# EAGLE schematic IR_Sensor (EAGLE 9.6.2)
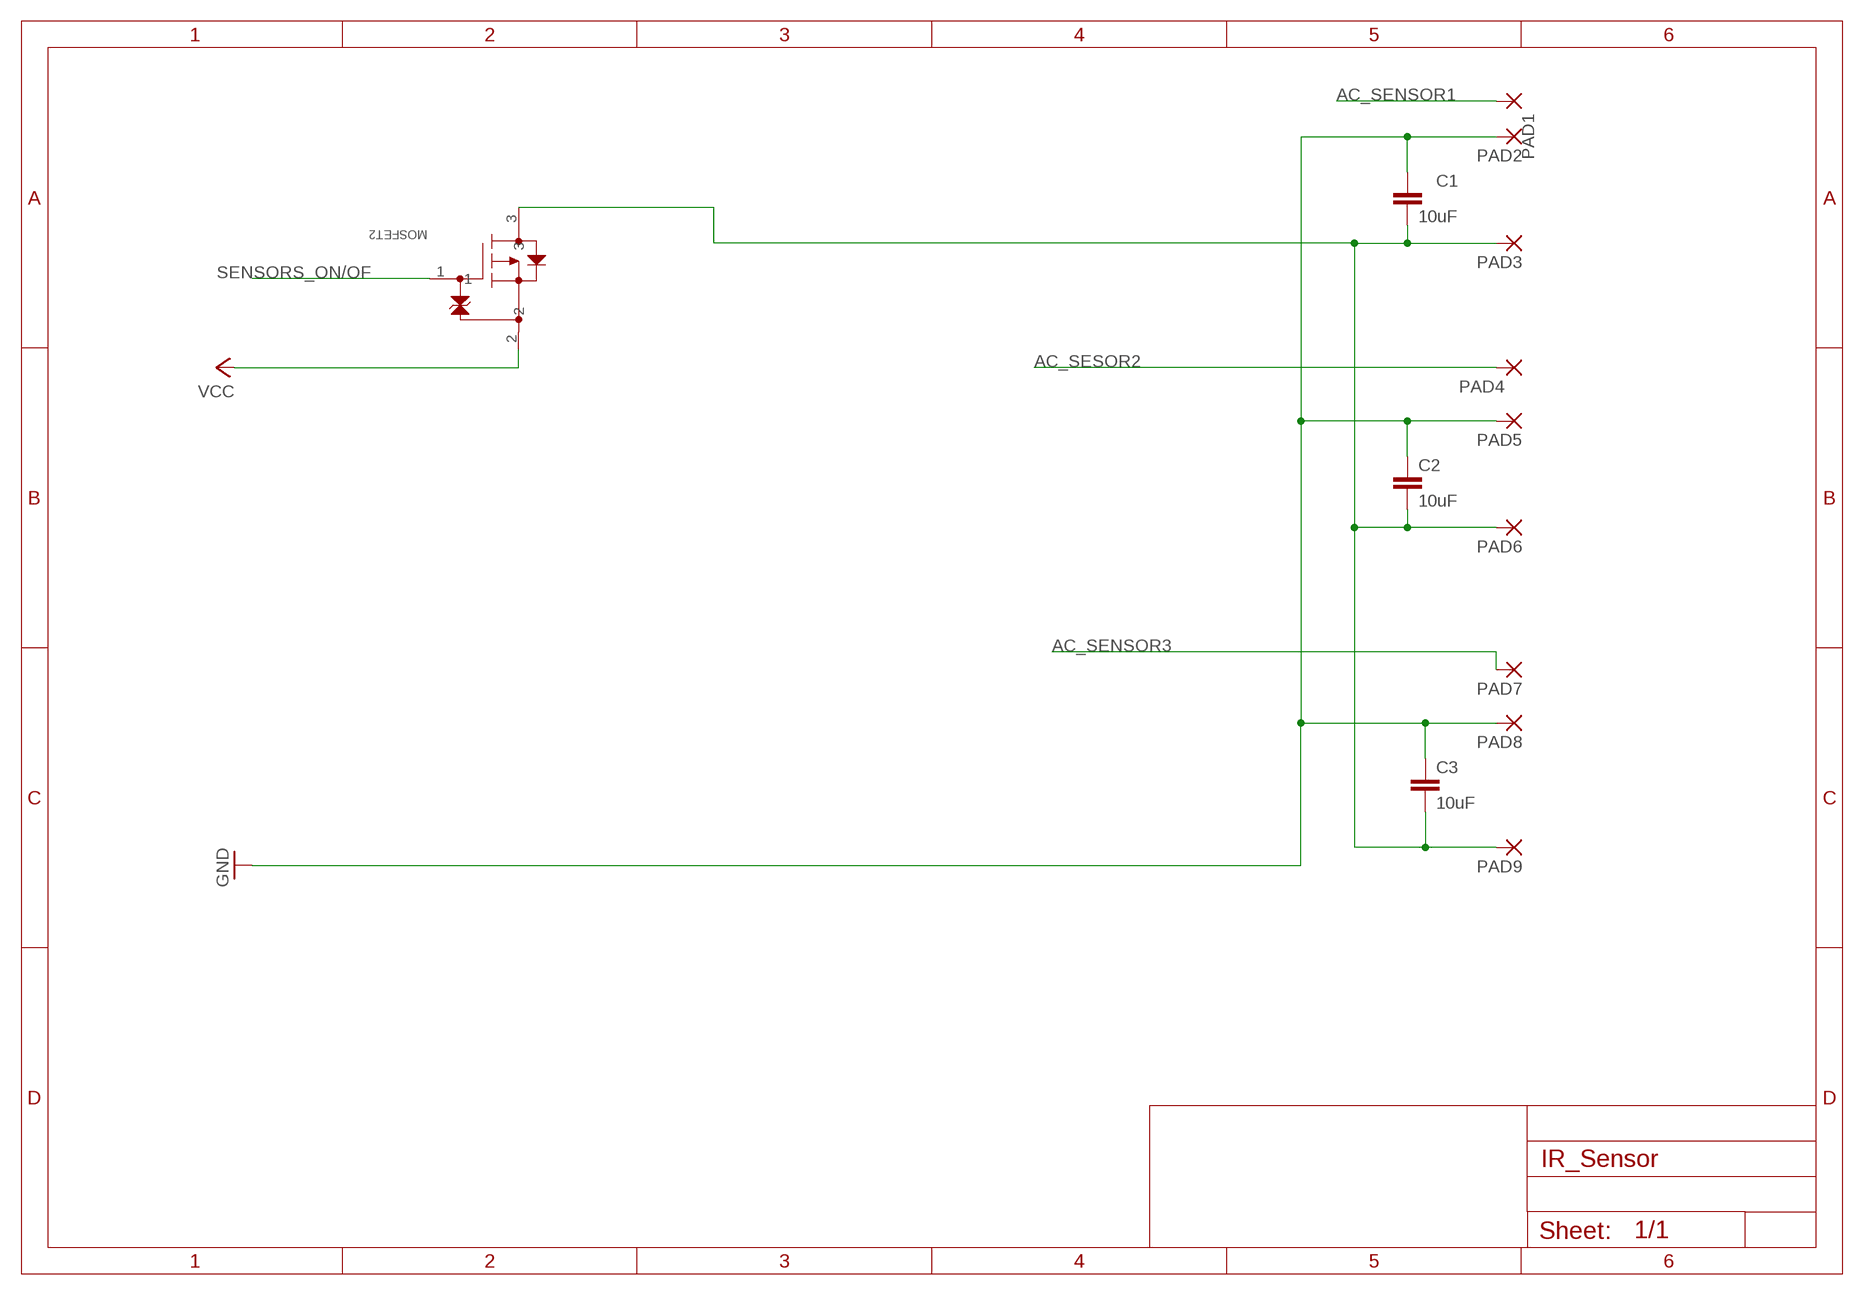
[diagram p0: schematic, sheet 1]

## Parts
C1  10uF  C-EUC0805  [C0805]
C2  10uF  C-EUC0805  [C0805]
C3  10uF  C-EUC0805  [C0805]
MOSFET2  SSM3J117TU(TE85L)  [UFM_TOS]
PAD1  1,6/0,8  [1,6/0,8]
PAD2  1,6/0,8  [1,6/0,8]
PAD3  1,6/0,8  [1,6/0,8]
PAD4  1,6/0,8  [1,6/0,8]
PAD5  1,6/0,8  [1,6/0,8]
PAD6  1,6/0,8  [1,6/0,8]
PAD7  1,6/0,8  [1,6/0,8]
PAD8  1,6/0,8  [1,6/0,8]
PAD9  1,6/0,8  [1,6/0,8]

## Nets
AC_SENSOR1: PAD1.1(P)
AC_SENSOR3: PAD7.1(P)
AC_SESOR2: PAD4.1(P)
GND: C1.1 C2.1 C3.1 PAD2.1(P) PAD5.1(P) PAD8.1(P)
N$2: C1.2 C2.2 C3.2 MOSFET2.3 PAD3.1(P) PAD6.1(P) PAD9.1(P)
SENSORS_ON/OF: MOSFET2.1
VCC: MOSFET2.2

## Library data of the parts
C1-C3 = rcl:C-EU: CAPACITOR, European symbol; SPICEPREFIX: C
MOSFET2 = SSM3J117TU:SSM3J117TU(TE85L); COPYRIGHT: Copyright (C) 2022 Ultra Librarian. All rights reserved.; MANUFACTURER_PART_NUMBER: SSM3J117TU(TE85L); MFR_NAME: Toshiba Electronic Devices & Storage Co.
PAD1-PAD9 = wirepad:1,6/0,8: THROUGH-HOLE PAD